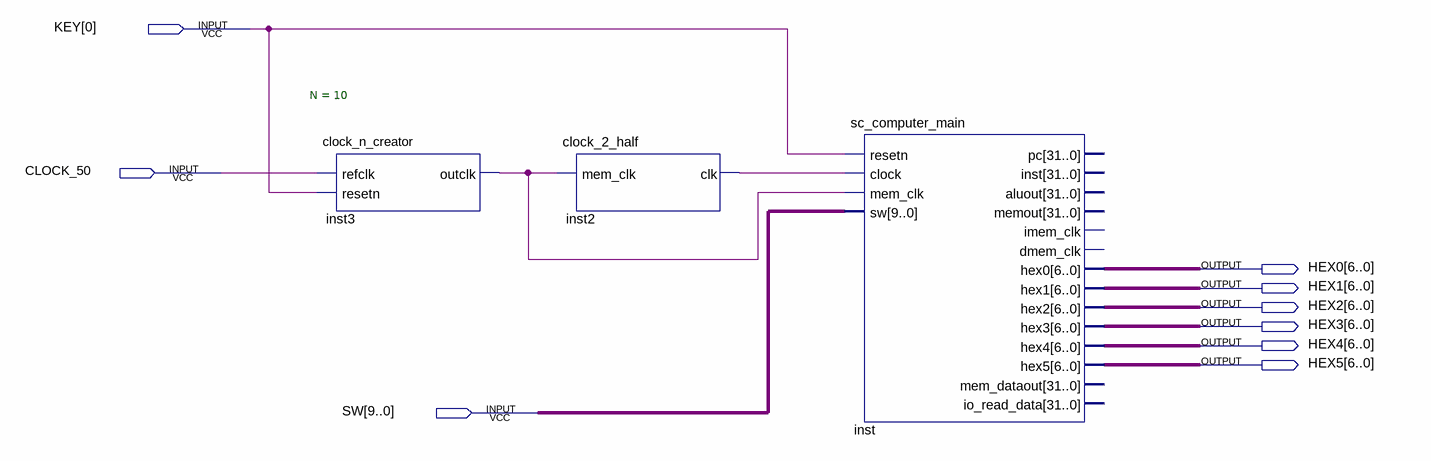
[diagram p0: schematic sheet]
// Quartus schematic sc_computer.bdf as structural Verilog: 3 symbols, 9 pins
module sc_computer (
  input  [0:0] KEY,
  input  CLOCK_50,
  input  [9:0] SW,
  output [6:0] HEX0,
  output [6:0] HEX1,
  output [6:0] HEX2,
  output [6:0] HEX3,
  output [6:0] HEX4,
  output [6:0] HEX5
);

  wire inst2_clk, inst3_outclk;

  clock_n_creator #(.N(10)) inst3 (.refclk(CLOCK_50), .resetn(KEY[0]), .outclk(inst3_outclk));
  clock_2_half inst2 (.mem_clk(inst3_outclk), .clk(inst2_clk));
  sc_computer_main inst (
    .resetn(KEY[0]), .clock(inst2_clk), .mem_clk(inst3_outclk), .sw(SW), .hex0(HEX0), .hex1(HEX1),
    .hex2(HEX2), .hex3(HEX3), .hex4(HEX4), .hex5(HEX5));  // open: pc, inst, aluout, memout, imem_clk, dmem_clk, mem_dataout, io_read_data
endmodule
